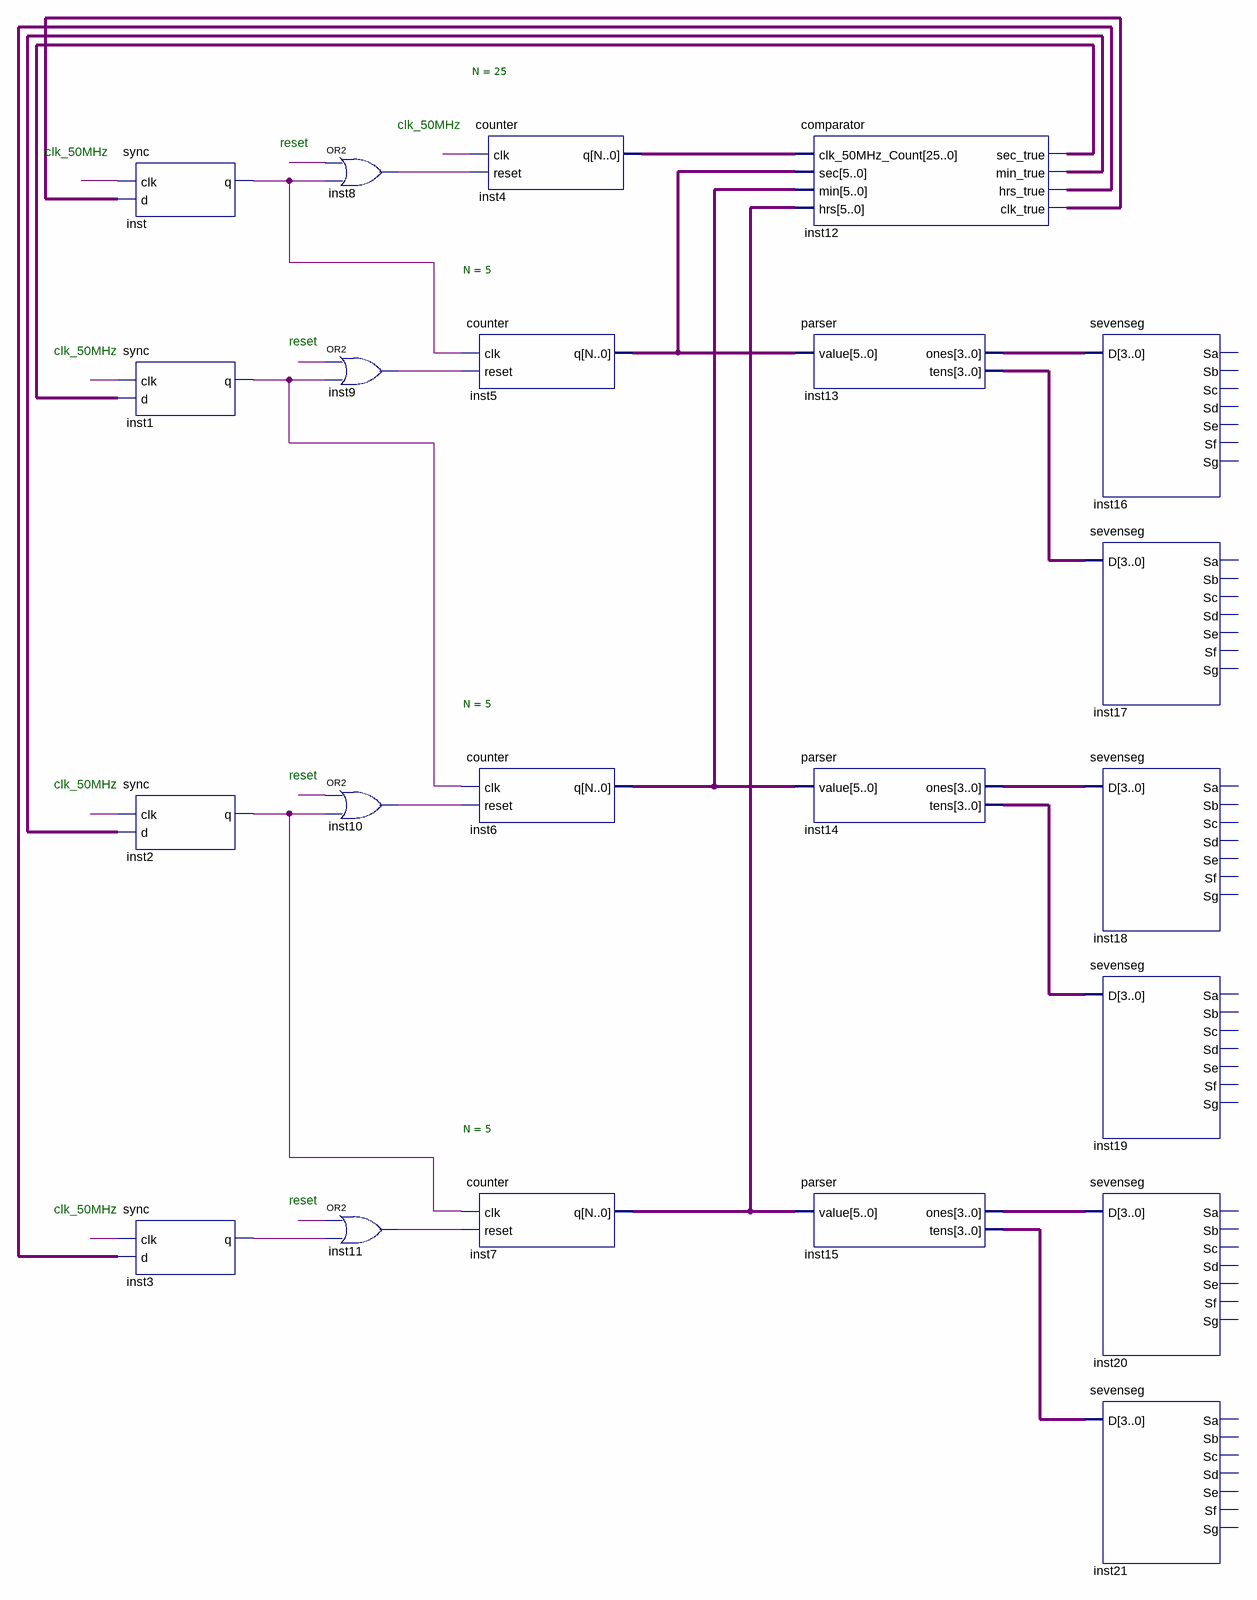
[diagram p0: schematic sheet]
// Quartus schematic Lab5_block.bdf as structural Verilog: 22 symbols, 0 pins
module Lab5_block (
);

  wire inst1_q, inst2_q, inst3_q, inst8_out, inst9_out, inst10_out, inst11_out, inst12_clk_true,
       inst12_hrs_true, inst12_min_true, inst12_sec_true, inst_q, undriven, undriven_2, undriven_3,
       undriven_4, undriven_5, undriven_6, undriven_7, undriven_8, undriven_9;
  wire [3:0] inst13_ones, inst13_tens, inst14_ones, inst14_tens, inst15_ones, inst15_tens;
  wire [5:0] inst5_q, inst6_q, inst7_q;
  wire [25:0] inst4_q;

  sync inst (.clk(undriven_3), .d(inst12_clk_true), .q(inst_q));
  sync inst1 (.clk(undriven_4), .d(inst12_sec_true), .q(inst1_q));
  sync inst2 (.clk(undriven_6), .d(inst12_min_true), .q(inst2_q));
  sync inst3 (.clk(undriven_8), .d(inst12_hrs_true), .q(inst3_q));
  or inst8 (inst8_out, undriven, inst_q);
  or inst9 (inst9_out, undriven_5, inst1_q);
  or inst10 (inst10_out, undriven_7, inst2_q);
  or inst11 (inst11_out, undriven_9, inst3_q);
  counter #(.N(25)) inst4 (.clk(undriven_2), .reset(inst8_out), .q(inst4_q));
  counter #(.N(5)) inst5 (.clk(inst_q), .reset(inst9_out), .q(inst5_q));
  counter #(.N(5)) inst6 (.clk(inst1_q), .reset(inst10_out), .q(inst6_q));
  counter #(.N(5)) inst7 (.clk(inst2_q), .reset(inst11_out), .q(inst7_q));
  comparator inst12 (
    .clk_50MHz_Count(inst4_q), .sec(inst5_q), .min(inst6_q), .hrs(inst7_q), .sec_true(inst12_sec_true),
    .min_true(inst12_min_true), .hrs_true(inst12_hrs_true), .clk_true(inst12_clk_true));
  parser inst13 (.value(inst5_q), .ones(inst13_ones), .tens(inst13_tens));
  parser inst14 (.value(inst6_q), .ones(inst14_ones), .tens(inst14_tens));
  parser inst15 (.value(inst7_q), .ones(inst15_ones), .tens(inst15_tens));
  sevenseg inst16 (.D(inst13_ones));  // open: Sa, Sb, Sc, Sd, Se, Sf, Sg
  sevenseg inst17 (.D(inst13_tens));  // open: Sa, Sb, Sc, Sd, Se, Sf, Sg
  sevenseg inst18 (.D(inst14_ones));  // open: Sa, Sb, Sc, Sd, Se, Sf, Sg
  sevenseg inst19 (.D(inst14_tens));  // open: Sa, Sb, Sc, Sd, Se, Sf, Sg
  sevenseg inst20 (.D(inst15_ones));  // open: Sa, Sb, Sc, Sd, Se, Sf, Sg
  sevenseg inst21 (.D(inst15_tens));  // open: Sa, Sb, Sc, Sd, Se, Sf, Sg

  // Notes on the sheet:
  //   clk_50MHz
  //   reset
  //   clk_50MHz
  //   reset
  //   clk_50MHz
  //   reset
  //   clk_50MHz
  //   reset
  //   clk_50MHz
endmodule
